# EAGLE design VRS_V1.5 (EAGLE 9.5.2)
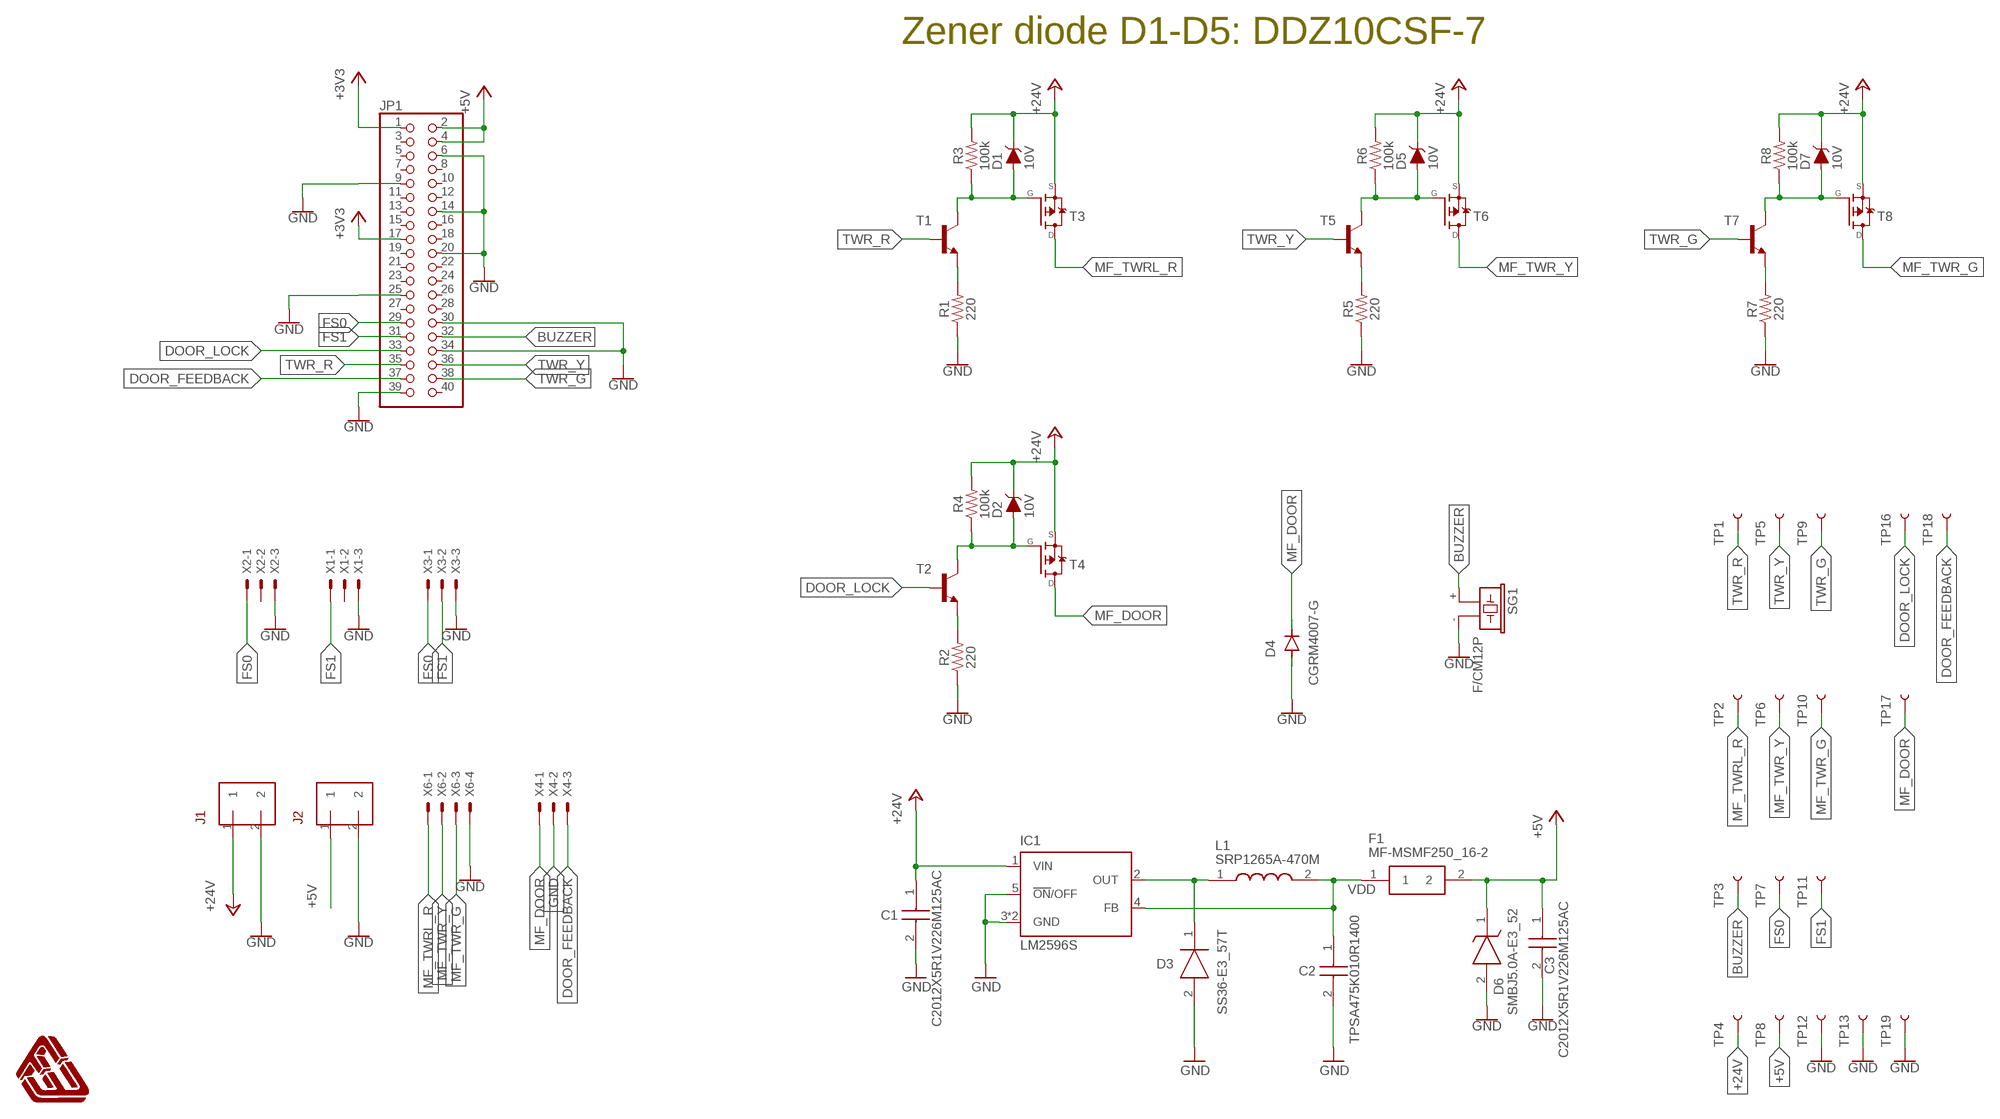
[diagram p0: schematic, sheet 1]

## Parts
C1  C2012X5R1V226M125AC  [CAPC2012X145N]
C2  TPSA475K010R1400  [CAPPM3216X180N]
C3  C2012X5R1V226M125AC  [CAPC2012X145N]
D1  10V  DIODE-ZENER-DZ2J150M0L  [PANASONIC_SMINI2-F5-B]
D2  10V  DIODE-ZENER-DZ2J150M0L  [PANASONIC_SMINI2-F5-B]
D3  SS36-E3_57T  [DIOM7959X262N]
D4  CGRM4007-G  [SOD-123_MINI-SMA]
D5  10V  DIODE-ZENER-DZ2J150M0L  [PANASONIC_SMINI2-F5-B]
D6  SMBJ5.0A-E3_52  [DIOM5436X244N]
D7  10V  DIODE-ZENER-DZ2J150M0L  [PANASONIC_SMINI2-F5-B]
F1  MF-MSMF250_16-2  [FUSC4632X160N]
FWLOGO_1  FWLOGO  [FWLOGO]
IC1  LM2596S  [LM2596_TO263-5]
J1  TERMINALBLOCK/TOYO/2PIN/5MMPITCH  [TERMINALBLOCK/TOYO/2PIN/5MMPITCH]
J2  TERMINALBLOCK/TOYO/2PIN/5MMPITCH  [TERMINALBLOCK/TOYO/2PIN/5MMPITCH]
JP1  RASPBERRYPI_3B_GPIO  [RASPBERRYPI_3B_GPIO]
L1  SRP1265A-470M  [SRP1265A]
R1  220  100KOHM-0603-1/10W-1%  [0603]
R2  220  100KOHM-0603-1/10W-1%  [0603]
R3  100k  100KOHM-0603-1/10W-1%  [0603]
R4  100k  100KOHM-0603-1/10W-1%  [0603]
R5  220  100KOHM-0603-1/10W-1%  [0603]
R6  100k  100KOHM-0603-1/10W-1%  [0603]
R7  220  100KOHM-0603-1/10W-1%  [0603]
R8  100k  100KOHM-0603-1/10W-1%  [0603]
SG1  F/CM12P  [F/CM12P]
T1  MMBT3904LT1-NPN-SOT23-BEC  [SOT23-BEC]
T2  MMBT3904LT1-NPN-SOT23-BEC  [SOT23-BEC]
T3  MOSFET_P_SOT223  [MOSFET_SOT223]
T4  MOSFET_P_SOT223  [MOSFET_SOT223]
T5  MMBT3904LT1-NPN-SOT23-BEC  [SOT23-BEC]
T6  MOSFET_P_SOT223  [MOSFET_SOT223]
T7  MMBT3904LT1-NPN-SOT23-BEC  [SOT23-BEC]
T8  MOSFET_P_SOT223  [MOSFET_SOT223]
TP1  TEST-POINT3X5  [PAD.03X.05]
TP2  TEST-POINT3X5  [PAD.03X.05]
TP3  TEST-POINT3X5  [PAD.03X.05]
TP4  TEST-POINT3X5  [PAD.03X.05]
TP5  TEST-POINT3X5  [PAD.03X.05]
TP6  TEST-POINT3X5  [PAD.03X.05]
TP7  TEST-POINT3X5  [PAD.03X.05]
TP8  TEST-POINT3X5  [PAD.03X.05]
TP9  TEST-POINT3X5  [PAD.03X.05]
TP10  TEST-POINT3X5  [PAD.03X.05]
TP11  TEST-POINT3X5  [PAD.03X.05]
TP12  TEST-POINT3X5  [PAD.03X.05]
TP13  TEST-POINT3X5  [PAD.03X.05]
TP16  TEST-POINT3X5  [PAD.03X.05]
TP17  TEST-POINT3X5  [PAD.03X.05]
TP18  TEST-POINT3X5  [PAD.03X.05]
TP19  TEST-POINT3X5  [PAD.03X.05]
X1  FS1  JST-XH-03-PIN-LONG-PAD  [JST-XH-03-PACKAGE-LONG-PAD]
X2  FS0  JST-XH-03-PIN-LONG-PAD  [JST-XH-03-PACKAGE-LONG-PAD]
X3  ENCODER  JST-XH-03-PIN-LONG-PAD  [JST-XH-03-PACKAGE-LONG-PAD]
X4  DOOR LOCK  JST-XH-03-PIN-LONG-PAD  [JST-XH-03-PACKAGE-LONG-PAD]
X6  TOWER LIGHT  JST-XH-04-PIN-LONG-PAD  [JST-XH-04-PACKAGE-LONG-PAD]

## Nets
+3V3: JP1.1 JP1.17
+5V: C3.1 D6.1(K) F1.2 J2.1 JP1.2 JP1.4 TP8.P$1
+24V: C1.1 D1.C D2.C D5.C D7.C IC1.1(VIN) J1.1 R3.2 R4.2 R6.2 R8.2 T3.3(S) T4.3(S) T6.3(S) T8.3(S) TP4.P$1
BUZZER: JP1.32 SG1.+ TP3.P$1
DOOR_FEEDBACK: JP1.37 TP18.P$1 X4.3
DOOR_LOCK: JP1.33 T2.B TP16.P$1
FS0: JP1.29 TP7.P$1 X2.1 X3.1
FS1: JP1.31 TP11.P$1 X1.1 X3.2
GND: C1.2 C2.2 C3.2 D3.2(A) D4.A D6.2(A) IC1.3(GND) IC1.5(!ON!/OFF) IC1.6(GND) J1.2 J2.2 JP1.6 JP1.9 JP1.14 JP1.20 JP1.25 JP1.30 JP1.34 JP1.39 R1.1 R2.1 R5.1 R7.1 SG1.- TP12.P$1 TP13.P$1 TP19.P$1 X1.3 X2.3 X3.3 X4.2 X6.4
MF_DOOR: D4.C T4.2(D) T4.4(D) TP17.P$1 X4.1
MF_TWR_G: T8.2(D) T8.4(D) TP10.P$1 X6.3
MF_TWR_Y: T6.2(D) T6.4(D) TP6.P$1 X6.2
MF_TWRL_R: T3.2(D) T3.4(D) TP2.P$1 X6.1
N$1: R1.2 T1.E
N$2: D3.1(K) IC1.2(OUT) L1.1
N$3: D5.A R6.1 T5.C T6.1(G)
N$4: D1.A R3.1 T1.C T3.1(G)
N$8: R5.2 T5.E
N$9: D7.A R8.1 T7.C T8.1(G)
N$10: R7.2 T7.E
N$13: D2.A R4.1 T2.C T4.1(G)
N$14: R2.2 T2.E
TWR_G: JP1.38 T7.B TP9.P$1
TWR_R: JP1.35 T1.B TP1.P$1
TWR_Y: JP1.36 T5.B TP5.P$1
VDD: C2.1 F1.1 IC1.4(FB) L1.2
Unconnected: JP1.3 JP1.5 JP1.7 JP1.8 JP1.10 JP1.11 JP1.12 JP1.13 JP1.15 JP1.16 JP1.18 JP1.19 JP1.21 JP1.22 JP1.23 JP1.24 JP1.26 JP1.27 JP1.28 JP1.40 X1.2 X2.2

## Notes on the sheet
- Zener diode D1-D5: DDZ10CSF-7

## Library data of the parts
C1 C3 = SamacSys_Parts:C2012X5R1V226M125AC: TDK 0805 C 22uF Ceramic Multilayer Capacitor, 35 V dc, +85C, X5R Dielectric, +/-20% Source: Datasheet <https://product.tdk.com/info/en/catalog/datasheets/mlcc_commercial_midvoltage_en.pdf>; DESCRIPTION: TDK 0805 C 22uF Ceramic Multilayer Capacitor, 35 V dc, +85C, X5R Dielectric, +/-20%; HEIGHT: 1.45mm; MANUFACTURER_NAME: TDK; MANUFACTURER_PART_NUMBER: C2012X5R1V226M125AC; MOUSER_PART_NUMBER: 810-C2012X5R1V226MAC; MOUSER_PRICE-STOCK: https://www.mouser.com/Search/Refine.aspx?Keyword=810-C2012X5R1V226MAC; RS_PART_NUMBER: 9159334P; RS_PRICE-STOCK: http://uk.rs-online.com/web/p/products/9159334P
C2 = SamacSys_Parts:TPSA475K010R1400: AVX 4.7 Source: Datasheet <http://datasheets.avx.com/TPS.pdf>; ALLIED_NUMBER: 70002395; ALLIED_PRICE-STOCK: http://www.alliedelec.com/avx-tpsa475k010r1400/70002395/; DESCRIPTION: AVX 4.7; HEIGHT: 1.8mm; MANUFACTURER_NAME: AVX; MANUFACTURER_PART_NUMBER: TPSA475K010R1400; MOUSER_PART_NUMBER: 581-TPSA475K010R1400; MOUSER_PRICE-STOCK: https://www.mouser.com/Search/Refine.aspx?Keyword=581-TPSA475K010R1400; RS_PART_NUMBER: 1366129; RS_PRICE-STOCK: http://uk.rs-online.com/web/p/products/1366129
D1 D2 D5 D7 = SparkFun-DiscreteSemi:DIODE-ZENER: Zener Diode A Zener diode allows current to flow from its anode to its cathode like a normal semiconductor diode, but it also permits current to flow in the reverse direction when its "Zener voltage" is reached. - WIkipedia; PROD_ID: DIO-12989; VALUE: 15V
D3 = SamacSys_Parts:SS36-E3_57T: SS36-E3/57T, Schottky Diode, 3A max, 60V, 2-Pin, SMC Source: Datasheet <https://componentsearchengine.com/Datasheets/2/SS36-E3_57T.pdf>; ALLIED_NUMBER: 70217328; ALLIED_PRICE-STOCK: https://www.alliedelec.com/general-semiconductor-vishay-ss36-e3-57t/70217328/; DESCRIPTION: SS36-E3/57T, Schottky Diode, 3A max, 60V, 2-Pin, SMC; HEIGHT: 2.62mm; MANUFACTURER_NAME: Vishay; MANUFACTURER_PART_NUMBER: SS36-E3/57T; MOUSER_PART_NUMBER: 625-SS36-E3; MOUSER_PRICE-STOCK: https://www.mouser.com/Search/Refine.aspx?Keyword=625-SS36-E3; RS_PART_NUMBER: 7000975P; RS_PRICE-STOCK: http://uk.rs-online.com/web/p/products/7000975P
D4 = diode:CGRM400*-G: Molded plasitc,JEDEC SOD-123/Mini SMA Source: Comchip CGRM4001-G.pdf
D6 = SamacSys_Parts:SMBJ5.0A-E3_52: Vishay SMBJ5.0A-E3/52, Uni-Directional TVS Diode, 600W, 2-Pin DO-214AA Source: Datasheet <https://www.vishay.com/docs/88392/smbj.pdf>; ALLIED_NUMBER: 70217303; ALLIED_PRICE-STOCK: https://www.alliedelec.com/generalsemiconductor-vishay-smbj5-0a-e3-52/70217303/; DESCRIPTION: Vishay SMBJ5.0A-E3/52, Uni-Directional TVS Diode, 600W, 2-Pin DO-214AA; HEIGHT: 2.44mm; MANUFACTURER_NAME: Vishay; MANUFACTURER_PART_NUMBER: SMBJ5.0A-E3/52; MOUSER_PART_NUMBER: 625-SMBJ5.0A-E3; MOUSER_PRICE-STOCK: https://www.mouser.com/Search/Refine.aspx?Keyword=625-SMBJ5.0A-E3; RS_PART_NUMBER: 1652507; RS_PRICE-STOCK: http://uk.rs-online.com/web/p/products/1652507
F1 = SamacSys_Parts:MF-MSMF250_16-2: BOURNS - MF-MSMF250/16-2 - FUSE, RESETTABLE PTC, 16V, 2.5A, 1812 Source: Datasheet <https://www.bourns.com/pdfs/mfmsmf.pdf>; DESCRIPTION: BOURNS - MF-MSMF250/16-2 - FUSE, RESETTABLE PTC, 16V, 2.5A, 1812; HEIGHT: 1.6mm; MANUFACTURER_NAME: Bourns; MANUFACTURER_PART_NUMBER: MF-MSMF250/16-2; MOUSER_PART_NUMBER: 652-MF-MSMF250/16-2; MOUSER_PRICE-STOCK: https://www.mouser.com/Search/Refine.aspx?Keyword=652-MF-MSMF250%2F16-2; RS_PART_NUMBER: 6478229P; RS_PRICE-STOCK: http://uk.rs-online.com/web/p/products/6478229P
FWLOGO_1 = FracktalWorks:FWLOGO: Fracktal Works Logo without name
IC1 = FracktalWorks:LM2596: SIMPLE SWITCHER® Power Converter 150 kHz 3A Step-Down Voltage Regulator Source: http://www.national.com/ds/LM/LM2596.pdf; MF: NATIONAL SEMICONDUCTOR; MPN: LM2596S-ADJ/NOPB; OC_FARNELL: 9494367; OC_NEWARK: 41K3842
J1 J2 = FracktalWorks:TERMINALBLOCK/TOYO/2PIN/5MMPITCH
JP1 = FracktalWorks:RASPBERRYPI_3B_GPIO
L1 = SamacSys_Parts:SRP1265A-470M: Bourns SRP1265A Series Shielded Wire-wound SMD Inductor with a Carbonyl Powder Core, 47 uH 20% 6.5A Idc Source: Datasheet <https://www.bourns.com/docs/Product-Datasheets/SRP1265A.pdf>; DESCRIPTION: Bourns SRP1265A Series Shielded Wire-wound SMD Inductor with a Carbonyl Powder Core, 47 uH 20% 6.5A Idc; HEIGHT: mm; MANUFACTURER_NAME: Bourns; MANUFACTURER_PART_NUMBER: SRP1265A-470M; MOUSER_PART_NUMBER: 652-SRP1265A-470M; MOUSER_PRICE-STOCK: https://www.mouser.com/Search/Refine.aspx?Keyword=652-SRP1265A-470M; RS_PART_NUMBER: 8193513P; RS_PRICE-STOCK: http://uk.rs-online.com/web/p/products/8193513P
R1 R2 R5 R7 = SparkFun-Resistors:100KOHM: 100kΩ resistor A resistor is a passive two-terminal electrical component that implements electrical resistance as a circuit element. Resistors act to reduce current flow, and, at the same time, act to lower voltage levels within circuits. - Wikipedia; PROD_ID: RES-07828; VALUE: 100k
R3 R4 R6 R8 = SparkFun-Resistors:100KOHM: 100kΩ resistor A resistor is a passive two-terminal electrical component that implements electrical resistance as a circuit element. Resistors act to reduce current flow, and, at the same time, act to lower voltage levels within circuits. - Wikipedia; PROD_ID: RES-07828
SG1 = buzzer:F/CM12P: BUZZER Source: Buerklin; OC_FARNELL: unknown; OC_NEWARK: unknown
T1 T2 T5 T7 = transistor:*-NPN-: NPN Transistror BF959 corrected 2008.03.06
T3 T4 T6 T8 = FracktalWorks:MOSFET_P_SOT223: MOSFET P channel SOT-223 device
TP1-TP13 TP16-TP19 = SparkFun-Connectors:TEST-POINT: SparkFun Test Points Bare copper test points for troubleshooting or In-Circuit-Testing. These are used by our Production team for verifying production board runs using pogo-pins on test beds. SparkFun Products: SparkFun LSM9DS1 Breakout <https://www.sparkfun.com/products/13284> SparkFun PSOC <https://www.sparkfun.com/products/13714> SparkFun Load Cell Amplifier <https://www.sparkfun.com/products/13879>
X1-X4 = Rembrandt:JST-XH-03-PIN: JST XH Connector 2 Pin Wire to board connector. Pitch: 2,54 mm, (0.100") Number of pins: 3 Created by Rembrandt Electronics www.rembrandtelectronics.com
X6 = Rembrandt:JST-XH-04-PIN: JST XH Connector 2 Pin Wire to board connector. Pitch: 2,54 mm, (0.100") Number of pins: 4 Created by Rembrandt Electronics www.rembrandtelectronics.com

## Board
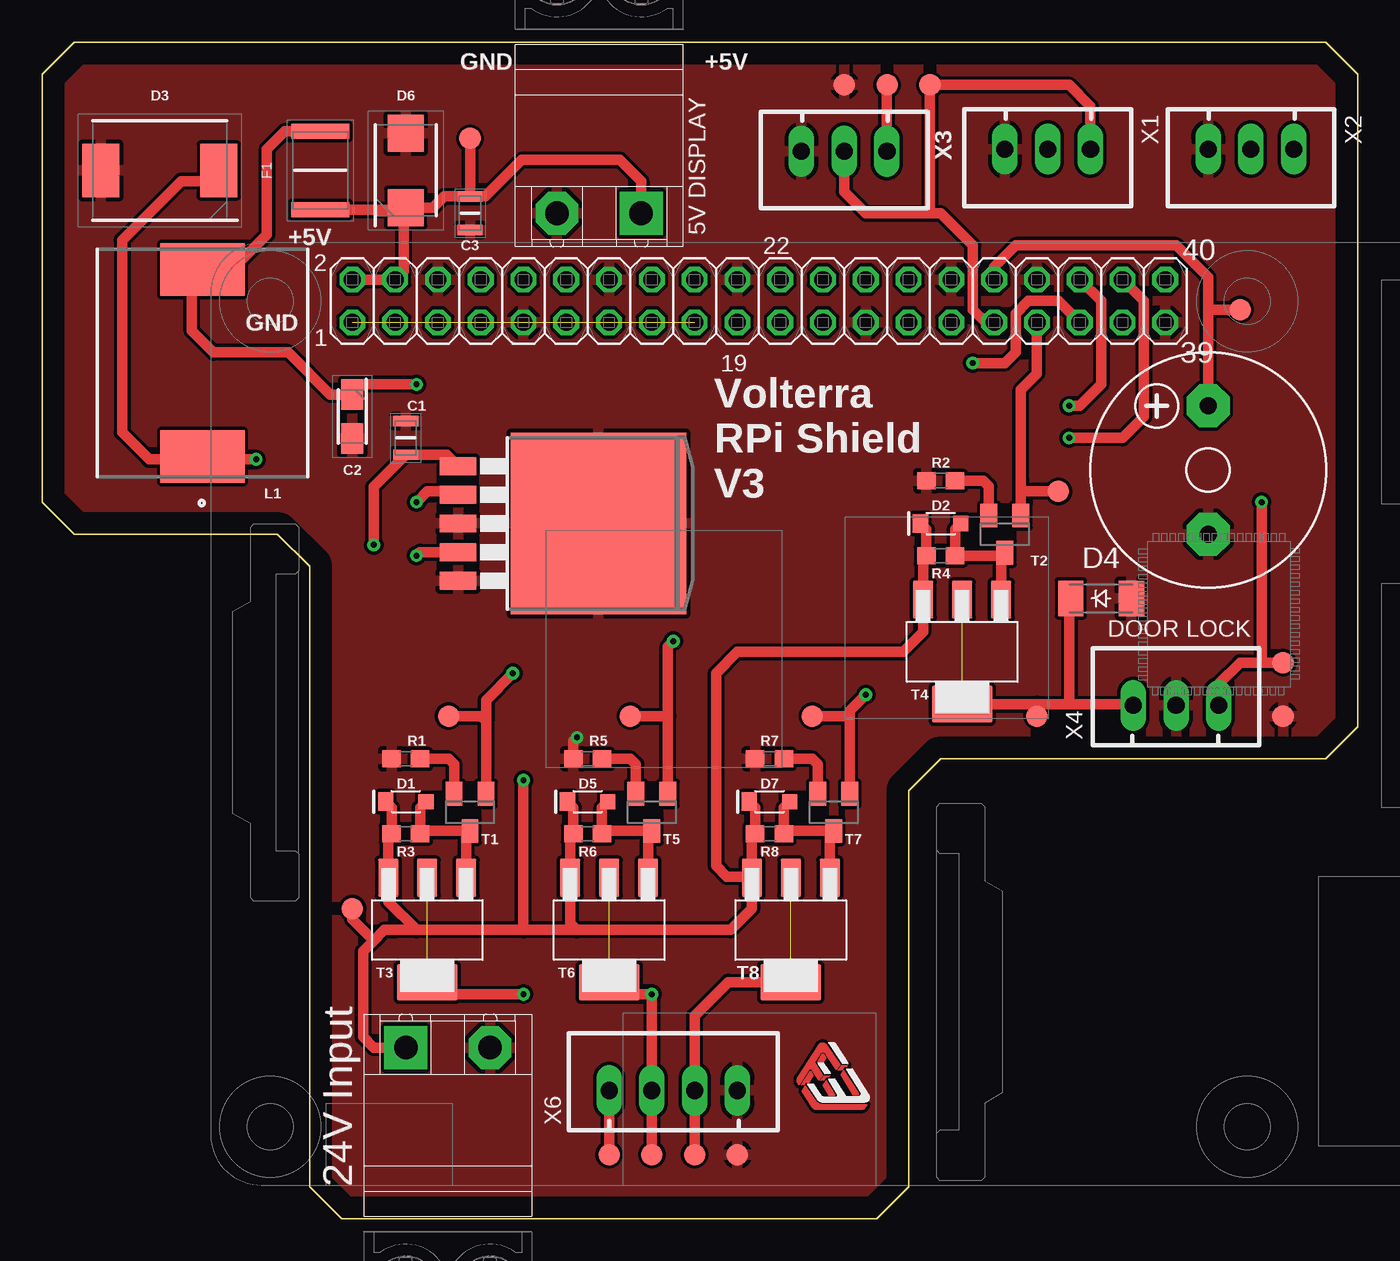
[diagram p1: board, top side]
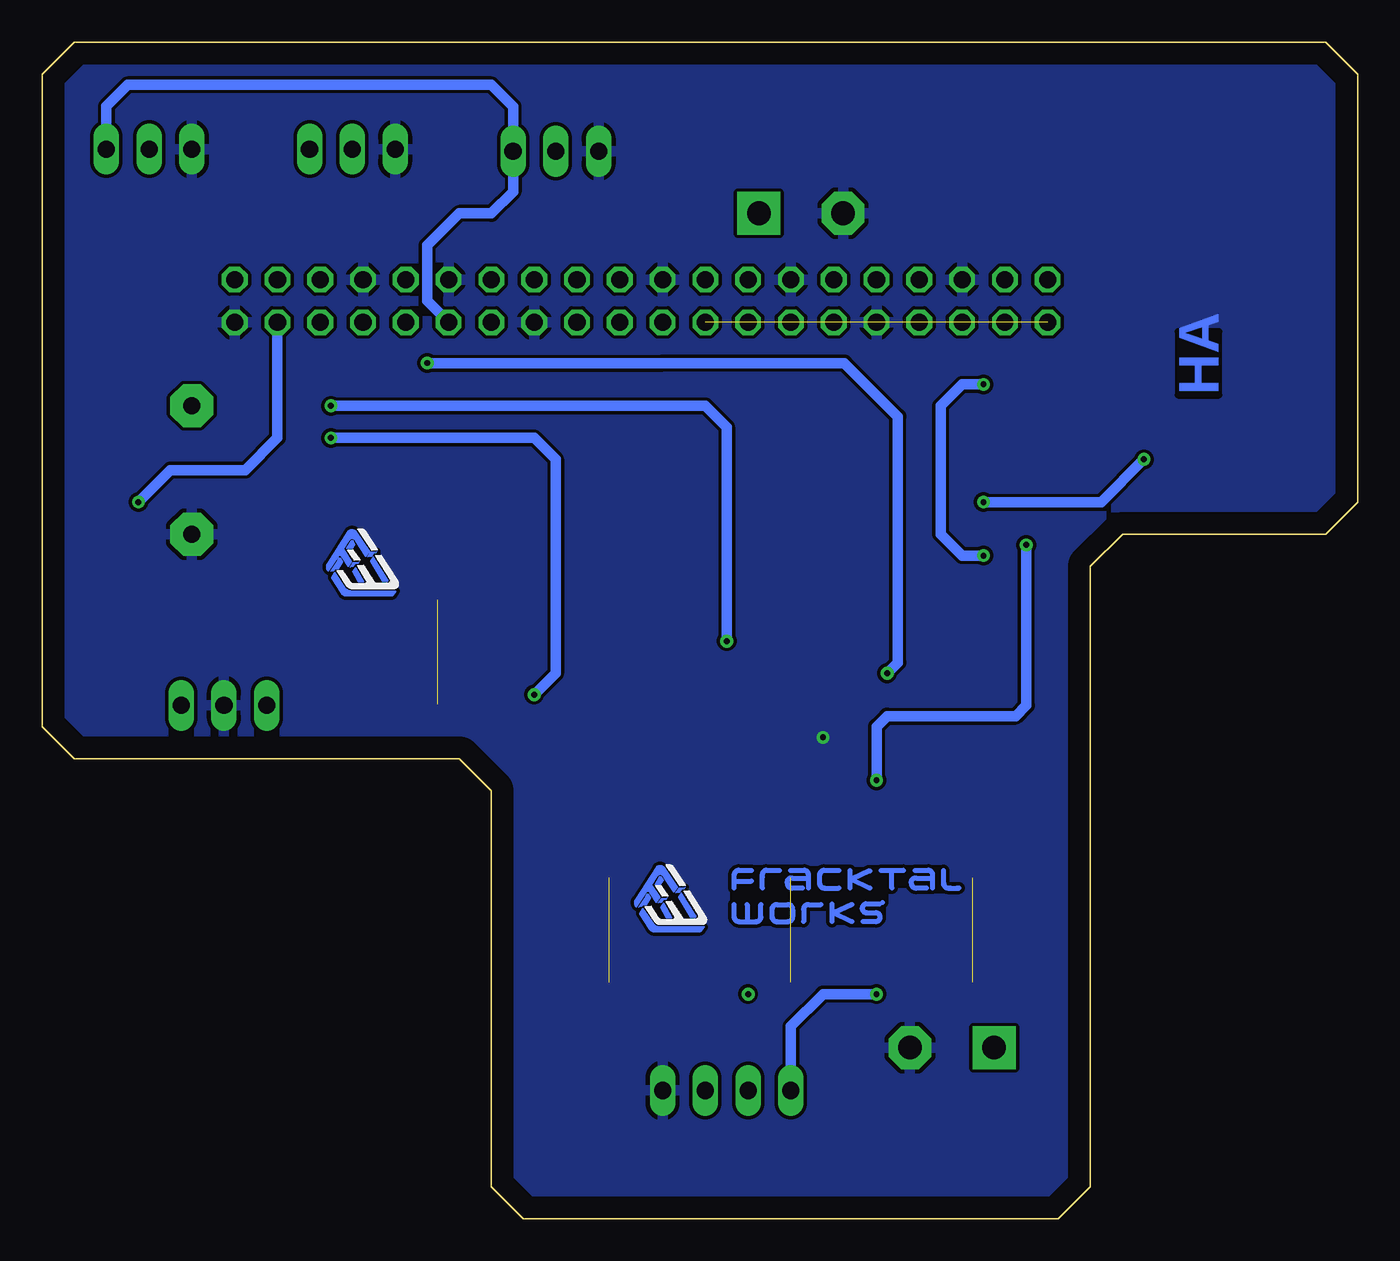
[diagram p2: board, bottom side, seen from below]

Size 78.1 x 69.85 mm. Coordinates in mm from the lower left corner, seen from the top.
Outline: 51.44,1.91 51.44,25.4 53.34,27.3 76.2,27.3 78.1,29.21 78.1,67.94 76.2,69.85 1.91,69.85 0,67.94 0,42.55 1.91,40.64 13.97,40.64 15.88,38.73 15.88,1.91 17.78,0 49.53,0 51.44,1.91
Copper layers (1*16): Top 0.035mm / dielectric 1.5mm / Bottom 0.035mm
Design rules "LionCircuits": minimum track width 8mil, minimum drill 0.35mm, track to track 8mil, track to pad 8mil, pad to pad 8mil, via to via 8mil, smd to smd 8mil, copper to edge 50mil, drill to drill 10mil, minimum pad ring 10mil, minimum via ring 8mil, stop-mask expansion 4mil, vias tented up to drill 0mil, thermal gap 10mil

### Footprints (pad centres in the part's own frame; a part is rotated, then mirrored left to right if it is on the bottom)
CAPC2012X145N = smd 0.62 x 1.47: 1 -1,0; 2 1,0
CAPPM3216X180N = smd 1.8 x 1.3: 1 -1.3,0; 2 1.3,0
PANASONIC_SMINI2-F5-B = smd 0.9 x 0.9: A 1.2,0 | smd 0.9 x 1.1: C -1.2,0
DIOM7959X262N = smd 2.2 x 3.15: 1 -3.5,0; 2 3.5,0
SOD-123_MINI-SMA = smd 1.5 x 2.1: A 1.8,0; C -1.8,0
DIOM5436X244N = smd 2.2 x 2.15: 1 -2.2,0; 2 2.2,0
FUSC4632X160N = smd 0.89 x 3.43: 1 -2.325,0; 2 2.325,0
LM2596_TO263-5 = smd 1.067 x 2.159: 1 -3.404,-5.791; 2 -1.702,-5.791; 3 0,-5.791; 4 1.702,-5.791; 5 3.404,-5.791 | smd 10.8 x 10.41: 6 0,2.54
TERMINALBLOCK/TOYO/2PIN/5MMPITCH = drill 1.4 pad 2.54 square: 1 0,0 | drill 1.4 pad 2.54 octagon: 2 5,0
RASPBERRYPI_3B_GPIO = drill 1.016 octagon: 1 -24.13,-1.27; 2 -24.13,1.27; 3 -21.59,-1.27; 4 -21.59,1.27; 5 -19.05,-1.27; 6 -19.05,1.27; 7 -16.51,-1.27; 8 -16.51,1.27; 9 -13.97,-1.27; 10 -13.97,1.27; 11 -11.43,-1.27; 12 -11.43,1.27; 13 -8.89,-1.27; 14 -8.89,1.27; 15 -6.35,-1.27; 16 -6.35,1.27; 17 -3.81,-1.27; 18 -3.81,1.27; 19 -1.27,-1.27; 20 -1.27,1.27; 21 1.27,-1.27; 22 1.27,1.27; 23 3.81,-1.27; 24 3.81,1.27; 25 6.35,-1.27; 26 6.35,1.27; 27 8.89,-1.27; 28 8.89,1.27; 29 11.43,-1.27; 30 11.43,1.27; 31 13.97,-1.27; 32 13.97,1.27; 33 16.51,-1.27; 34 16.51,1.27; 35 19.05,-1.27; 36 19.05,1.27; 37 21.59,-1.27; 38 21.59,1.27; 39 24.13,-1.27; 40 24.13,1.27
SRP1265A = smd 3.1 x 5: 1 -5.55,0; 2 5.55,0
0603 = smd 1.1 x 1: 1 -0.85,0; 2 0.85,0
F/CM12P = drill 1.016 pad 2.54 octagon: + 3.81,0; - -3.81,0
SOT23-BEC = smd 1 x 1.4: B -0.95,-1.1; C 0,1.1; E 0.95,-1.1
MOSFET_SOT223 = smd 2.235 x 1.219: 1 -3.099,2.311; 2 -3.099,0; 3 -3.099,-2.311 | smd 2.2 x 3.6: 4 3.099,0
PAD.03X.05 = smd 1.27 x 1.27: P$1 0,0
JST-XH-03-PACKAGE-LONG-PAD = drill 1.016 long: 1 -2.54,0; 2 0,0; 3 2.54,0
JST-XH-04-PACKAGE-LONG-PAD = drill 1.016 long: 1 -3.81,0; 2 -1.27,0; 3 1.27,0; 4 3.81,0

### Placement (x,y rotation side)
C1  21.59,46.35 90 top
C2  18.41,47.62 270 top
C3  25.4,59.69 270 top
D1  21.59,24.77 0 top
D2  53.34,41.27 0 top
D3  6.99,62.23 180 top
D4  62.87,36.83 0 top
D5  32.39,24.77 0 top
D6  21.59,62.23 90 top
D7  43.18,24.77 0 top
F1  16.51,62.23 270 top
FWLOGO_1  43.31,5.33 0 top
IC1  30.48,41.27 270 top
J1  21.59,10.16 0 top
J2  35.56,59.69 180 top
JP1  42.55,54.48 0 top
L1  9.53,50.8 90 top
M_HA_3  HA_MARK  [HA_MARK]  8.26,48.9 90 bottom
R1  21.59,27.3 0 top
R2  53.34,43.81 0 top
R3  21.59,22.86 180 top
R4  53.34,39.37 180 top
R5  32.39,27.3 0 top
R6  32.39,22.86 180 top
R7  43.18,27.3 0 top
R8  43.18,22.86 180 top
SG1  69.22,44.45 90 top
T1  25.4,24.13 180 top
T2  57.15,40.64 180 top
T3  22.86,17.14 270 top
T4  54.61,33.66 270 top
T5  36.2,24.13 180 top
T6  33.66,17.14 270 top
T7  46.99,24.13 180 top
T8  44.45,17.14 270 top
TP1  24.13,29.84 0 top
TP2  33.66,3.81 0 top
TP3  71.12,53.98 0 top
TP4  18.41,18.41 0 top
TP5  34.92,29.84 0 top
TP6  36.2,3.81 0 top
TP7  50.16,67.31 0 top
TP8  25.4,64.13 0 top
TP9  45.72,29.84 0 top
TP10  38.73,3.81 0 top
TP11  52.7,67.31 0 top
TP12  41.27,3.81 0 top
TP13  73.66,29.84 0 top
TP16  60.33,43.18 0 top
TP17  59.05,29.84 0 top
TP18  73.66,33.02 0 top
TP19  47.62,67.31 0 top
U$2  FWLOGO_TEXT_SMALL  [FWLOGO_TEXT_SMALL]  43.18,15.88 0 bottom
U$3  FWLOGO  [FWLOGO]  62.74,35.81 0 bottom
X1  59.69,63.5 180 top
X2  71.75,63.5 180 top
X3  47.61,63.37 180 top
X4  67.31,30.48 0 top
X6  37.47,7.62 0 top

### Tracks (layer width: path | path; a pad name or v marks a point on that pad's centre or on a via)
+3V3  (1 unrouted)
+5V
  Top 0.61: 21.46,59.91 D6.1 | F1.2 21.46,59.91 | 21.46,59.91 D6.1 | D6.1 23.2,60.03 23.86,60.69 C3.1 | JP1.2 JP1.4 21.46,56.26 21.46,59.91 | C3.1 TP8.P$1 | C3.1 26.3,60.69 28.48,62.87 34.29,62.87 35.56,61.59 J2.1
+24V  (via drill 0.35)
  Top 0.61: D1.C 20.74,24.41 R3.2 20.55,22.67 T3.3 20.55,18.82 22.23,17.14 | D5.C 31.54,24.41 R6.2 31.34,22.67 T6.3 31.34,17.55 31.75,17.14 | T8.3 42.14,22.67 R8.2 42.33,24.41 D7.C | D2.C 52.49,40.92 R4.2 52.3,39.18 T4.3 52.3,34.85 51.1,33.66 41.27,33.66 40.01,32.39 40.01,20.96 40.64,20.32 42.06,20.32 T8.3 | T8.3 42.14,18.41 40.87,17.14 31.75,17.14 | v19.69,40.01 19.69,43.45 C1.1 24.01,45.35 IC1.1 | 31.75,17.14 28.57,17.14 | 28.57,17.14 22.23,17.14 | 19.69,16.51 19.05,15.88 19.05,10.79 19.69,10.16 J1.1 | 19.69,16.51 20.32,17.14 20.96,17.14 22.23,17.14 | 28.57,17.14 v28.57,26.04 | TP4.P$1 18.41,17.78 19.69,16.51
  Bottom 0.61: v28.57,26.04 28.57,29.21 27.94,29.84 20.32,29.84 19.69,30.48 v19.69,40.01
BUZZER
  Top 0.61: JP1.32 56.52,56.52 57.79,57.79 67.31,57.79 69.22,55.88 69.22,53.98 | SG1.+ 69.22,53.98 | TP3.P$1 69.22,53.98
DOOR_FEEDBACK  (via drill 0.35)
  Top 0.61: X4.3 69.85,31.75 71.12,33.02 72.39,33.02 | 72.39,33.02 TP18.P$1 | v72.39,42.55 72.39,33.02
  Bottom 0.61: v72.39,42.55 70.49,44.45 66.04,44.45 64.13,46.35 JP1.37
DOOR_LOCK
  Top 0.61: T2.B 58.1,43.18 | 58.1,43.18 58.1,43.81 58.1,49.21 59.05,50.16 JP1.33 | TP16.P$1 58.1,43.18
FS0
  Top 0.61: X3.1 50.15,67.3 TP7.P$1
  Bottom 0.61: JP1.29 55.24,54.48 55.24,57.79 53.34,59.69 51.44,59.69 50.15,60.98 X3.1 50.15,66.03 51.44,67.31 73.03,67.31 74.29,66.04 X2.1
FS1
  Top 0.61: JP1.31 56.01,53.21 55.24,53.98 55.24,57.79 53.34,59.69 52.7,59.69 | X3.2 47.61,60.98 48.9,59.69 52.7,59.69 | 52.7,59.69 TP11.P$1 60.96,67.31 62.23,66.04 X1.1
GND  (via drill 0.35)
  Top 0.61: R5.1 31.54,28.36 v31.75,28.57
  pour Top: -1.27,69.85 -1.27,-12.07 80.01,-12.07 80.01,70.49 -0.63,70.49
  pour Bottom: 0,69.85 0,-10.79 78.74,-10.79 78.74,69.85
MF_DOOR  (1 unrouted)
  Top 0.61: 55.32,29.84 T4.4 59.05,30.56 | D4.C 60.96,36.73 60.96,30.56 | TP17.P$1 59.05,30.56 | 59.05,30.56 60.96,30.56 | 60.96,30.56 64.69,30.56 X4.1
MF_TWR_G  (1 unrouted)
  Top 0.61: T8.4 40.72,14.05 38.73,12.07 X6.3 TP10.P$1
MF_TWR_Y  (via drill 0.35)  (1 unrouted)
  Top 0.61: T6.4 34.37,13.34 v36.2,13.34 X6.2 TP6.P$1
MF_TWRL_R  (via drill 0.35)  (1 unrouted)
  Top 0.61: T3.4 23.57,13.34 v28.57,13.34 | TP2.P$1 X6.1
  Bottom 0.61: v28.57,13.34 31.75,13.34 33.66,11.43 X6.1
N$1
  Top 0.61: T1.E 24.45,26.98 24.13,27.3 R1.2
N$2  (via drill 0.35)
  Top 0.61: v12.7,45.09 9.69,45.09 | 9.69,45.09 L1.1 | 9.69,45.09 6.35,45.09 4.75,46.68 4.75,58.09 8.26,61.59 9.85,61.59 D3.1 | v22.23,42.55 22.86,43.18 24.49,43.18 IC1.2
  Bottom 0.61: v22.23,42.55 15.24,42.55 v12.7,45.09
N$3
  Top 0.61: D5.A 33.23,24.41 R6.1 33.41,23.03 T5.C 35.97,22.8 T6.1
N$4
  Top 0.61: D1.A 22.44,24.41 R3.1 22.61,23.03 T1.C 25.17,22.8 T3.1
N$8
  Top 0.61: T5.E 35.25,26.98 34.92,27.3 R5.2
N$9
  Top 0.61: D7.A 44.03,24.41 R8.1 44.2,23.03 T7.C 46.76,22.8 T8.1
N$10
  Top 0.61: T7.E 46.04,26.98 45.72,27.3 R7.2
N$13
  Top 0.61: D2.A 54.19,40.92 R4.1 56.98,39.37 T2.C 56.92,39.31 T4.1
N$14
  Top 0.61: T2.E 56.2,43.49 55.88,43.81 R2.2
TWR_G  (via drill 0.35)
  Top 0.61: JP1.38 65.41,54.48 65.41,47.62 64.13,46.35 v60.96,46.35 | T7.B 47.94,29.84 | 47.94,29.84 47.94,30.16 v48.9,31.12 | TP9.P$1 47.94,29.84
  Bottom 0.61: v60.96,46.35 48.9,46.35 47.62,45.09 47.62,32.39 v48.9,31.12
TWR_R  (via drill 0.35)
  Top 0.61: T1.B 26.35,29.52 | TP1.P$1 26.03,29.84 26.35,29.52 | JP1.35 60.33,54.48 58.53,54.48 57.79,53.74 57.79,53.34 57.79,51.44 57.15,50.8 v55.24,50.8 | 26.35,29.52 | v27.94,32.39 26.35,30.8 26.35,29.52
  Bottom 0.61: v55.24,50.8 41.27,50.8 30.48,50.8 27.3,47.62 27.3,33.02 v27.94,32.39
TWR_Y  (via drill 0.35)
  Top 0.61: T5.B 37.15,29.84 | TP5.P$1 37.15,29.84 | JP1.36 62.87,54.48 62.87,49.53 61.59,48.26 v60.96,48.26 | 37.15,29.84 37.15,33.97 v37.47,34.29
  Bottom 0.61: v60.96,48.26 38.73,48.26 37.47,46.99 v37.47,34.29
VDD  (via drill 0.35)
  Top 0.61: v22.23,49.53 19.02,49.53 C2.1 17.12,48.92 14.61,51.44 10.16,51.44 8.89,52.7 8.89,55.72 L1.2 11.27,56.35 13.34,58.42 13.34,63.5 14.39,64.56 F1.1 | v22.23,39.37 22.43,39.57 IC1.4
  Bottom 0.61: v22.23,49.53 23.5,49.53 24.77,48.26 24.77,40.64 23.5,39.37 v22.23,39.37

### Text on the board
tPlace: 5V DISPLAY | Volterra / RPi Shield / V3 | DOOR LOCK | 24V Input
tNames: GND | +5V | +5V | 22 | 2 | 40 | GND | 1 | 19 | 39